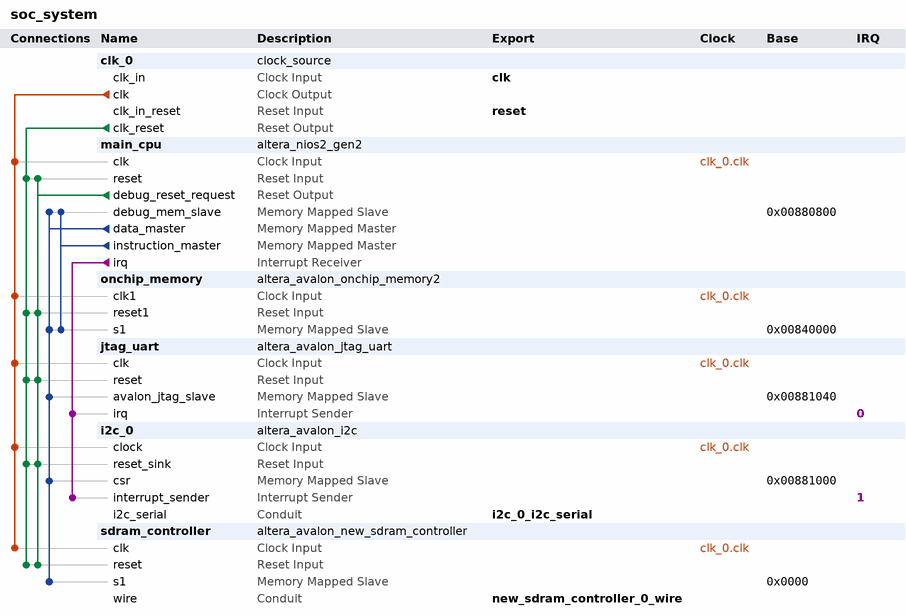
[diagram p0: system contents]
# Platform Designer (Qsys) system soc_system, Cyclone V 5CSEMA5F31C6
# Parameters at their usual value, and those the tool derives, are not listed.
package require -exact qsys 18.1
create_system soc_system
set_project_property DEVICE_FAMILY {Cyclone V}
set_project_property DEVICE 5CSEMA5F31C6

add_instance clk_0 clock_source 18.1
set_instance_parameter_value clk_0 clockFrequency 50000000

add_instance main_cpu altera_nios2_gen2 18.1
set_instance_parameter_value main_cpu dcache_size 2048
set_instance_parameter_value main_cpu exceptionSlave onchip_memory.s1
set_instance_parameter_value main_cpu icache_size 4096
set_instance_parameter_value main_cpu impl Fast
set_instance_parameter_value main_cpu resetSlave onchip_memory.s1

add_instance onchip_memory altera_avalon_onchip_memory2 18.1
set_instance_parameter_value onchip_memory dataWidth 32
set_instance_parameter_value onchip_memory dualPort false
set_instance_parameter_value onchip_memory initMemContent true
set_instance_parameter_value onchip_memory initializationFileName onchip_mem.hex
set_instance_parameter_value onchip_memory memorySize 204800

add_instance jtag_uart altera_avalon_jtag_uart 18.1
set_instance_parameter_value jtag_uart simInteractiveOptions NO_INTERACTIVE_WINDOWS

add_instance i2c_0 altera_avalon_i2c 18.1
set_instance_parameter_value i2c_0 FIFO_DEPTH 4

add_instance sdram_controller altera_avalon_new_sdram_controller 18.1
set_instance_parameter_value sdram_controller TAC 5.5
set_instance_parameter_value sdram_controller TRCD 20.0
set_instance_parameter_value sdram_controller TRP 20.0
set_instance_parameter_value sdram_controller casLatency 3
set_instance_parameter_value sdram_controller columnWidth 8
set_instance_parameter_value sdram_controller dataWidth 16
set_instance_parameter_value sdram_controller generateSimulationModel false
set_instance_parameter_value sdram_controller model single_Micron_MT48LC4M32B2_7_chip
set_instance_parameter_value sdram_controller numberOfBanks 4
set_instance_parameter_value sdram_controller numberOfChipSelects 1
set_instance_parameter_value sdram_controller powerUpDelay 100.0
set_instance_parameter_value sdram_controller refreshPeriod 15.625
set_instance_parameter_value sdram_controller rowWidth 12

# connections
add_connection clk_0.clk i2c_0.clock clock
add_connection clk_0.clk jtag_uart.clk clock
add_connection clk_0.clk main_cpu.clk clock
add_connection clk_0.clk onchip_memory.clk1 clock
add_connection clk_0.clk sdram_controller.clk clock
add_connection clk_0.clk_reset i2c_0.reset_sink reset
add_connection clk_0.clk_reset jtag_uart.reset reset
add_connection clk_0.clk_reset main_cpu.reset reset
add_connection clk_0.clk_reset onchip_memory.reset1 reset
add_connection clk_0.clk_reset sdram_controller.reset reset
add_connection main_cpu.debug_reset_request i2c_0.reset_sink reset
add_connection main_cpu.debug_reset_request jtag_uart.reset reset
add_connection main_cpu.debug_reset_request main_cpu.reset reset
add_connection main_cpu.debug_reset_request onchip_memory.reset1 reset
add_connection main_cpu.debug_reset_request sdram_controller.reset reset
add_connection main_cpu.data_master i2c_0.csr avalon
set_connection_parameter_value main_cpu.data_master/i2c_0.csr baseAddress 0x00881000
add_connection main_cpu.data_master jtag_uart.avalon_jtag_slave avalon
set_connection_parameter_value main_cpu.data_master/jtag_uart.avalon_jtag_slave baseAddress 0x00881040
add_connection main_cpu.data_master main_cpu.debug_mem_slave avalon
set_connection_parameter_value main_cpu.data_master/main_cpu.debug_mem_slave baseAddress 0x00880800
add_connection main_cpu.data_master onchip_memory.s1 avalon
set_connection_parameter_value main_cpu.data_master/onchip_memory.s1 baseAddress 0x00840000
add_connection main_cpu.data_master sdram_controller.s1 avalon
set_connection_parameter_value main_cpu.data_master/sdram_controller.s1 baseAddress 0x0000
add_connection main_cpu.instruction_master main_cpu.debug_mem_slave avalon
set_connection_parameter_value main_cpu.instruction_master/main_cpu.debug_mem_slave baseAddress 0x00880800
add_connection main_cpu.instruction_master onchip_memory.s1 avalon
set_connection_parameter_value main_cpu.instruction_master/onchip_memory.s1 baseAddress 0x00840000
add_connection main_cpu.irq i2c_0.interrupt_sender interrupt
set_connection_parameter_value main_cpu.irq/i2c_0.interrupt_sender irqNumber 1
add_connection main_cpu.irq jtag_uart.irq interrupt
set_connection_parameter_value main_cpu.irq/jtag_uart.irq irqNumber 0

# exported interfaces
add_interface clk clock sink
set_interface_property clk EXPORT_OF clk_0.clk_in
add_interface i2c_0_i2c_serial conduit end
set_interface_property i2c_0_i2c_serial EXPORT_OF i2c_0.i2c_serial
add_interface new_sdram_controller_0_wire conduit end
set_interface_property new_sdram_controller_0_wire EXPORT_OF sdram_controller.wire
add_interface reset reset sink
set_interface_property reset EXPORT_OF clk_0.clk_in_reset

set_interconnect_requirement {$system} qsys_mm.clockCrossingAdapter HANDSHAKE
set_interconnect_requirement {$system} qsys_mm.enableEccProtection FALSE
set_interconnect_requirement {$system} qsys_mm.insertDefaultSlave FALSE
set_interconnect_requirement {$system} qsys_mm.maxAdditionalLatency 1

save_system soc_system.qsys
